# Altium project DC-DC_Conv_MCU.PrjPcb
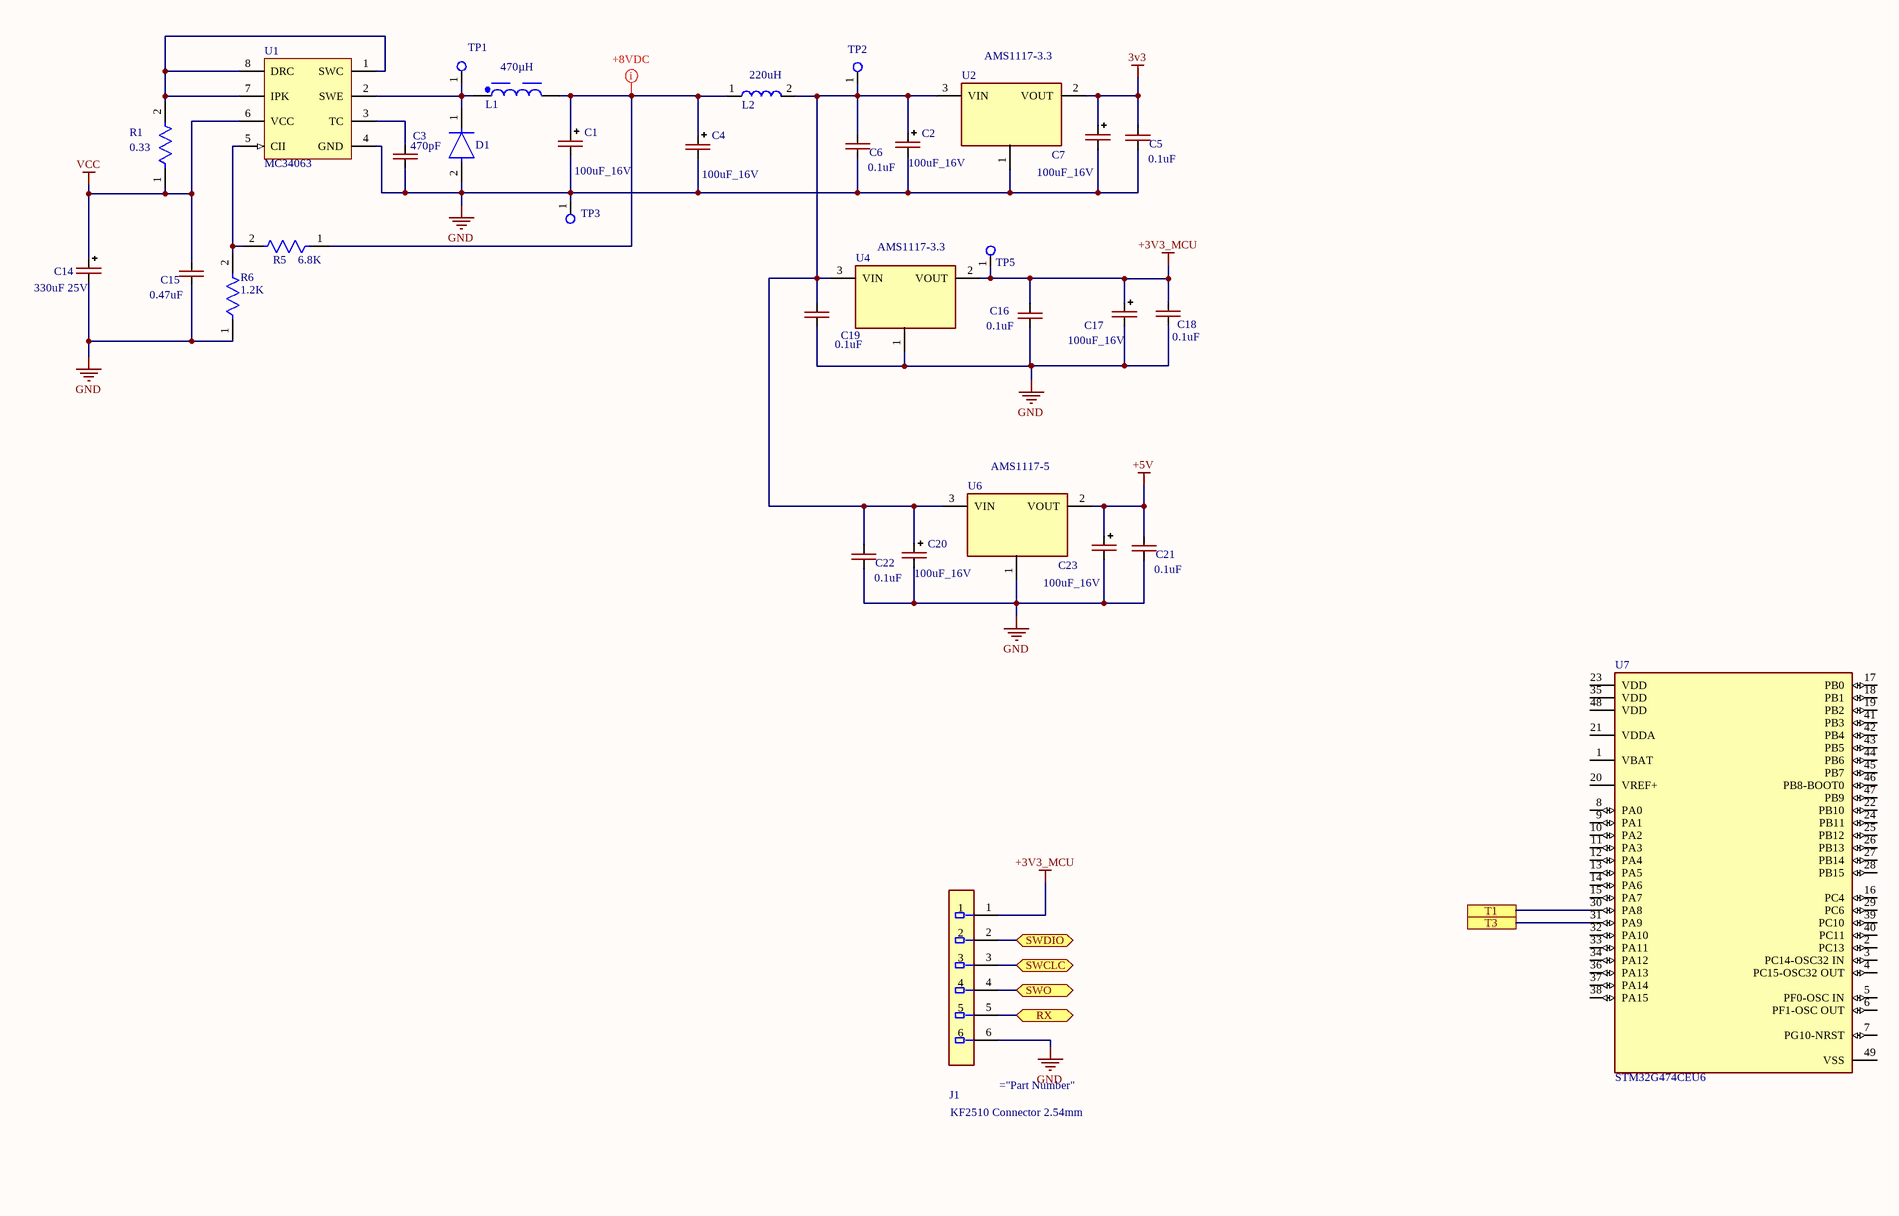
[diagram p0: DC-DC_Conv_MCU.SchDoc, top left]
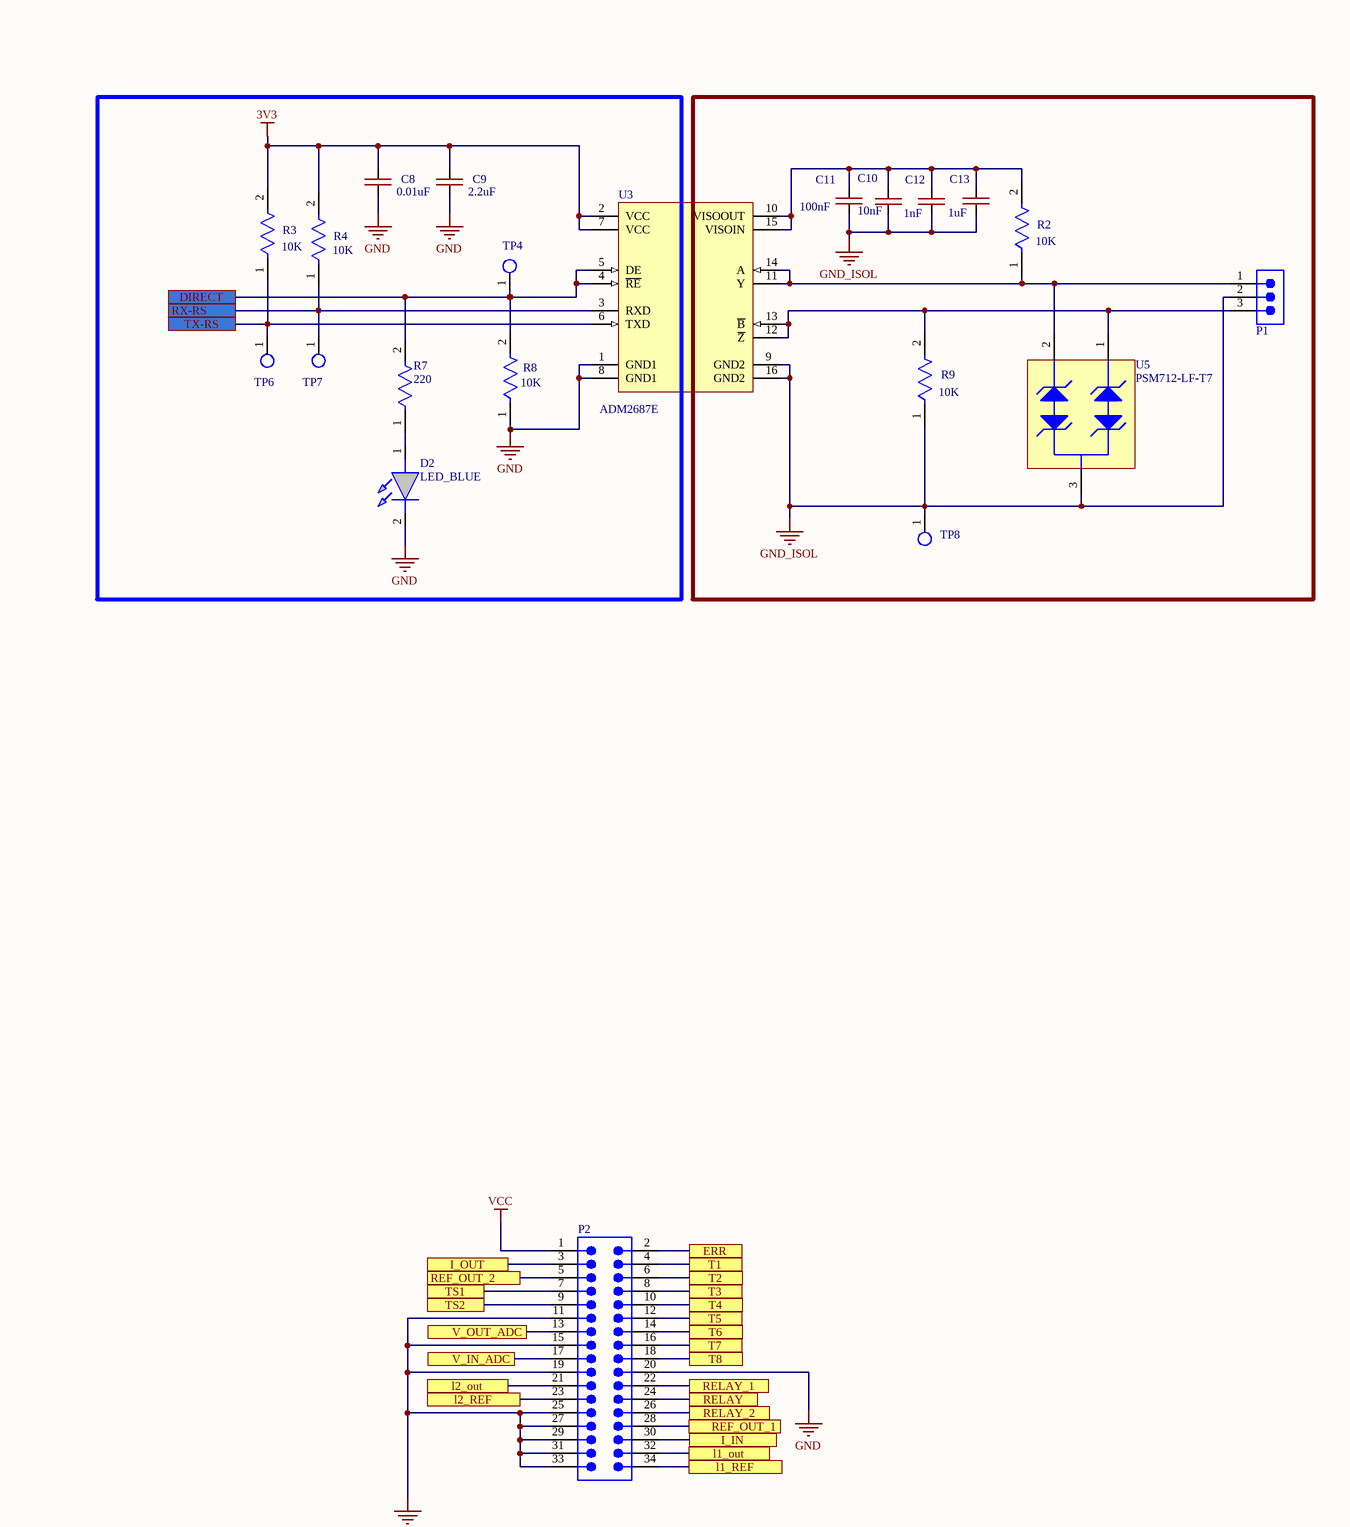
[diagram p1: DC-DC_Conv_MCU.SchDoc, top right]
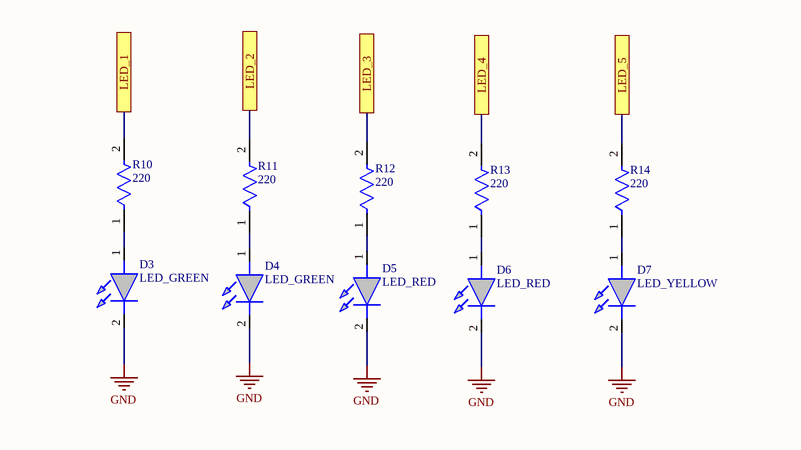
[diagram p2: DC-DC_Conv_MCU.SchDoc, bottom left]
1 sheet, 64 parts. Net scope: flat (ports and power ports of the same name join across sheets).
Board file: DC-DC_Conv_MCU.PcbDoc

## Sheet DC-DC_Conv_MCU.SchDoc
size A1; SheetNumber: 1; SheetTotal: 1; SPICEModelCacheFVOYAKUU: <root> / <DocumentId>FVOYAKUU</DocumentId> / <CacheFrame Number="0"> / <Model Name="5848_744774033_3.3u" Kind="CKT"> / <Text>******* / .subckt 5848_744774033_3.3u 1 2 / Rp 1 2 12000 / Cp 1 2 3.4p / Rs 1 N3 0.042 / L1 N3 2 3.3u / .ends 5848_744774033_3.3u</Text> / </Model> / </CacheFrame> / </root>

### Parts
C1  100uF_16V  [CAP-TAN-D]
C2  100uF_16V  [CAP-TAN-D]
C3  470pF  [CAP-0603]
C4  100uF_16V  [CAP-TAN-D]
C5  0.1uF  [CAP-0603]
C6  0.1uF  [CAP-0603]
C7  100uF_16V  [CAP-TAN-D]
C8  0.01uF  [CAP-0805]
C9  2.2uF  [CAP-0805]
C10  10nF  [CAP-0603]
C11  100nF  [CAP-0603]
C12  1nF  [CAP-0603]
C13  1uF  [CAP-0603]
C14  330uF 25V  [CAP_SMD_Size_E]
C15  0.47uF  [CAP-0805]
C16  0.1uF  [CAP-0603]
C17  100uF_16V  [CAP-TAN-D]
C18  0.1uF  [CAP-0603]
C19  0.1uF  [CAP-0603]
C20  100uF_16V  [CAP-TAN-D]
C21  0.1uF  [CAP-0603]
C22  0.1uF  [CAP-0603]
C23  100uF_16V  [CAP-TAN-D]
D1  ES1G  [FP-403AE-MFG]  (value not drawn)
D2  LED_BLUE  [LED_BLUE]
D3  LED_GREEN  [LED_GREEN]
D4  LED_GREEN  [LED_GREEN]
D5  LED_RED  [LED_RED]
D6  LED_RED  [LED_RED]
D7  LED_YELLOW  [LED_YELLOW]
J1  KF2510 Connector 2.54mm  [Sullins_SWR25X-NRTC-S06-ST-BA_MFG]
L1  470µH  [WE-PD2_5848]
L2  220uH  [Coil_4.5x4.5_mm]
P1  691305340003  [691305340003]  (value not drawn)
P2  61203421621  [61203421621]  (value not drawn)
R1  0.33  [RES-1206]
R2  10K  [RES-0603]
R3  10K  [RES-0603]
R4  10K  [RES-0603]
R5  6.8K  [RES-0805]
R6  1.2K  [RES-0805]
R7  220  [RES-0603]
R8  10K  [RES-0603]
R9  10K  [RES-0603]
R10  220  [RES-0603]
R11  220  [RES-0603]
R12  220  [RES-0603]
R13  220  [RES-0603]
R14  220  [RES-0603]
TP1  Test_Point_PCB  [Test_Point]  (value not drawn)
TP2  Test_Point_PCB  [Test_Point]  (value not drawn)
TP3  Test_Point_PCB  [Pin_Test_Point(Orange)]  (value not drawn)
TP4  Test_Point_PCB  [Test_Point]  (value not drawn)
TP5  Test_Point_PCB  [Test_Point]  (value not drawn)
TP6  Test_Point_PCB  [Test_Point]  (value not drawn)
TP7  Test_Point_PCB  [Test_Point]  (value not drawn)
TP8  Test_Point_PCB  [Test_Point]  (value not drawn)
U1  MC34063  [SOIC-8_M]
U2  AMS1117-3.3  [SOT-89]
U3  ADM2687E  [ADI-RI-16-2_M]
U4  AMS1117-3.3  [SOT-89]
U5  PSM712-LF-T7  [PRKT-SOT23-3_V]
U6  AMS1117-5  [SOT-89]
U7  STM32G474CEU6  [FP-UFQFPN48-A0B9-IPC_C]

### Ports
DIRECT, ERR, I_IN, I_OUT, l1_out, l1_REF, l2_out, l2_REF, LED_1, LED_2, LED_3, LED_4, LED_5, REF_OUT_1, REF_OUT_2, RELAY, RELAY_1, RELAY_2, RX (bidir), RX-RS, SWCLC (bidir), SWDIO (bidir), SWO (bidir), T1 (see DC-DC_Conv_MCU[5B]), T1 (see DC-DC_Conv_MCU[10B]), T2, T3 (see DC-DC_Conv_MCU[5B]), T3 (see DC-DC_Conv_MCU[10B]), T4, T5, T6, T7, T8, TS1, TS2, TX-RS, V_IN_ADC, V_OUT_ADC

### Nets
3v3: C5.2 C7.1(+) C8.1 C9.1 R3.2 R4.2 U2.2(VOUT) U3.2(VCC) U3.7(VCC)
+3V3_MCU: C16.2 C17.1(+) C18.2 J1.1 TP5.1(G9) U4.2(VOUT)
+5V: C21.2 C23.1(+) U6.2(VOUT)
GND: C1.2(-) C2.2(-) C3.2 C4.2(-) C5.1 C6.1 C7.2(-) C8.2 C9.2 C14.2(-) C15.2 C16.1 C17.2(-) C18.1 C19.1 C20.2(-) C21.1 C22.1 C23.2(-) D1.2(A) D2.2(K) D3.2(K) D4.2(K) D5.2(K) D6.2(K) D7.2(K) J1.6 P2.11 P2.15 P2.19 P2.20 P2.25 P2.27 P2.29 P2.31 P2.33 R6.1 R8.1 TP3.1(G9) U1.4(GND) U2.1(Ground) U3.1(GND1) U3.8(GND1) U4.1(Ground) U6.1(Ground)
GND_ISOL: C10.2 C11.2 C12.2 C13.2 P1.2 R9.1 TP8.1(G9) U3.9(GND2) U3.16(GND2) U5.3
VCC: C14.1(+) C15.1 P2.1 R1.1 U1.6(VCC)
NetC1_1: C1.1(+) C4.1(+) L1.2 L2.1 R5.1
NetC2_1: C2.1(+) C6.2 C19.2 C20.1(+) C22.2 L2.2 TP2.1(G9) U2.3(VIN) U4.3(VIN) U6.3(VIN)
NetC3_1: C3.1 U1.3(TC)
NetC10_1: C10.1 C11.1 C12.1 C13.1 R2.2 U3.10(VISOOUT) U3.15(VISOIN)
NetD1_1: D1.1(C) L1.1 TP1.1(G9) U1.2(SWE)
NetD2_1: D2.1(A) R7.1
NetD3_1: D3.1(A) R10.1
NetD4_1: D4.1(A) R11.1
NetD5_1: D5.1(A) R12.1
NetD6_1: D6.1(A) R13.1
NetD7_1: D7.1(A) R14.1
NetJ1_2: J1.2 ; port SWDIO
NetJ1_3: J1.3 ; port SWCLC
NetJ1_4: J1.4 ; port SWO
NetJ1_5: J1.5 ; port RX
NetP1_1: P1.1 R2.1 U3.11(Y) U3.14(A) U5.2
NetP1_3: P1.3 R9.2 U3.12(~{Z}) U3.13(~{B}) U5.1
NetP2_2: P2.2 ; port ERR
NetP2_3: P2.3 ; port I_OUT
NetP2_4: P2.4 U7.30(PA8) ; port T1
NetP2_5: P2.5 ; port REF_OUT_2
NetP2_6: P2.6 ; port T2
NetP2_7: P2.7 ; port TS1
NetP2_8: P2.8 U7.31(PA9) ; port T3
NetP2_9: P2.9 ; port TS2
NetP2_10: P2.10 ; port T4
NetP2_12: P2.12 ; port T5
NetP2_13: P2.13 ; port V_OUT_ADC
NetP2_14: P2.14 ; port T6
NetP2_16: P2.16 ; port T7
NetP2_17: P2.17 ; port V_IN_ADC
NetP2_18: P2.18 ; port T8
NetP2_21: P2.21 ; port l2_out
NetP2_22: P2.22 ; port RELAY_1
NetP2_23: P2.23 ; port l2_REF
NetP2_24: P2.24 ; port RELAY
NetP2_26: P2.26 ; port RELAY_2
NetP2_28: P2.28 ; port REF_OUT_1
NetP2_30: P2.30 ; port I_IN
NetP2_32: P2.32 ; port l1_out
NetP2_34: P2.34 ; port l1_REF
NetR1_2: R1.2 U1.1(SWC) U1.7(IPK) U1.8(DRC)
NetR3_1: R3.1 TP6.1(G9) U3.6(TXD) ; port TX-RS
NetR4_1: R4.1 TP7.1(G9) U3.3(RXD) ; port RX-RS
NetR5_2: R5.2 R6.2 U1.5(CII)
NetR7_2: R7.2 R8.2 TP4.1(G9) U3.4(~{RE}) U3.5(DE) ; port DIRECT
NetR10_2: R10.2 ; port LED_1
NetR11_2: R11.2 ; port LED_2
NetR12_2: R12.2 ; port LED_3
NetR13_2: R13.2 ; port LED_4
NetR14_2: R14.2 ; port LED_5

Not connected (* = marked no-connect by the designer): U7 1(VBAT) 2(PC13) 3(PC14-OSC32_IN) 4(PC15-OSC32_OUT) 5(PF0-OSC_IN) 6(PF1-OSC_OUT) 7(PG10-NRST) 8(PA0) 9(PA1) 10(PA2) 11(PA3) 12(PA4) 13(PA5) 14(PA6) 15(PA7) 16(PC4) 17(PB0) 18(PB1) 19(PB2) 20(VREF+) 21(VDDA) 22(PB10) 23(VDD) 24(PB11) 25(PB12) 26(PB13) 27(PB14) 28(PB15) 29(PC6) 32(PA10) 33(PA11) 34(PA12) 35(VDD) 36(PA13) 37(PA14) 38(PA15) 39(PC10) 40(PC11) 41(PB3) 42(PB4) 43(PB5) 44(PB6) 45(PB7) 46(PB8-BOOT0) 47(PB9) 48(VDD) 49(VSS)

### Layout directives
mark named +8VDC: (no net found under the mark)

### Library data of the parts
C1 C2 C4 C7 C14 C20 C23 = CAP_POL_SMD
C3 C5 C6 C8-C13 C15 C16 C18 C19 C21 C22 = CAP-NON-POLAR
C17 = CAP-POLAR
D1 = ES1G: Ultrafast
D2 = LED: 0805; Manufacturer_Name: Wurth Elektronik; Manufacturer_Part_Number: 151031YS06000; Geometry.Height: 5.5mm; Mouser Part Number: 710-151031YS06000; Mouser Price/Stock: https://www.mouser.co.uk/ProductDetail/Wurth-Elektronik/151031YS06000?qs=LlUlMxKIyB3xSYYW%252BcuBiQ%3D%3D; Arrow Part Number: *; Arrow Price/Stock: *; Mouser Testing Part Number: *; Mouser Testing Price/Stock: *; Datasheet Link: https://katalog.we-online.de/led/datasheet/151031YS06000.pdf
D3-D7 = LED: Manufacturer_Name: Wurth Elektronik; Manufacturer_Part_Number: 151031YS06000; Geometry.Height: 5.5mm; Mouser Part Number: 710-151031YS06000; Mouser Price/Stock: https://www.mouser.co.uk/ProductDetail/Wurth-Elektronik/151031YS06000?qs=LlUlMxKIyB3xSYYW%252BcuBiQ%3D%3D; Arrow Part Number: *; Arrow Price/Stock: *; Mouser Testing Part Number: *; Mouser Testing Price/Stock: *; Datasheet Link: https://katalog.we-online.de/led/datasheet/151031YS06000.pdf
J1 = SWR25X-NRTC-S06-ST-BA
L1 = 744774033: MSRH5D28-471MT; Manufacturer: Wurth Elektronik; Match Code: WE-PD2; Case/Size Code: 5848; DC Resistance: 0.042Ω; DC Resistance Max: 0.06Ω; Inductance: 3.3µH; Rated Current: 4A; Saturation Current: 7.5A; Self Resonant Frequency: 43MHz; Manufacturer Part Number: 744774033; Category: Unshielded Power Inductors; ComponentLink1Description: Website Link; ComponentLink1URL: https://www.we-online.com/redexpert/article/744774033?ad; ComponentLink2Description: Datasheet Link; ComponentLink2URL: https://www.we-online.com/redexpert/spec/744774033?ad; Mount: Surface Mount; Operating Temperature Max: 125°C; Operating Temperature Min: -40°C; Packaging: Tape and Reel; Length: 5.8mm; Width: 5.2mm; Height: 4.5mm
L2 = Coil
P1 = 691305340003: WR-TBL Series 3053 Horizontal PCB Header, THT, pitch 3.81mm, 3p; Manufacturer: Wurth Elektronik; Modularity: No; Rated Current: 12A; Working Voltage: 300V; ComponentLink1Description: Website Link; ComponentLink1URL: https://www.we-online.com/redexpert/article/691305340003?ad; ComponentLink2Description: Datasheet Link; ComponentLink2URL: https://www.we-online.com/redexpert/spec/691305340003?ad; Manufacturer Part Number: 691305340003; Category: Terminal Blocks; Match Code: WR-TBL; Mount: Through Hole; Operating Temperature Max: 105°C; Operating Temperature Min: -40°C; Packaging: Box; Application: Pluggable; Number of Pins: 3; Number of Rows: 1; Orientation: Horizontal; Pitch: 3.81mm
P2 = 61203421621: WR-BHD Male Box Header, THT Straight, pitch 2.54 mm, 2 Rows, 34 Pins; Manufacturer: Wurth Elektronik; Contact Resistance: 20 mΩ; Insulation Resistance: 1000 MΩ; Pitch: 2.54 mm; Rated Current: 3 A; Working Voltage: 250 V; Withstanding Voltage: 500 V; Manufacturer Part Number: 61203421621; Category: Wire-to-Board Connector; Connectors.Match Code: WR-BHD; ComponentLink1Description: Website Link; ComponentLink1URL: https://www.we-online.com/redexpert/article/61203421621?ad; ComponentLink2Description: Datasheet Link; ComponentLink2URL: https://www.we-online.com/redexpert/spec/61203421621?ad; Mount: Through Hole; Min Operating Temperature: -40 °C; Max Operating Temperature: 105 °C; Packaging: Tray; Length: 50.84 mm; Width: 9.1 mm; Height: 9.1 mm; Gender: Male; Number of Pins: 34; Number of Rows: 2; Orientation: Straight
R1-R14 = RES-CONST
TP1-TP8 = TP_PCB?: Test_Point
U2 U4 U6 = AMS1117
U5 = CMP-2000-07553-1: TVS Array - Asymmetrical Data Line Protector, 600 W, 7.5 V, -55 to 150 degC, 3-Pin SOT23, RoHS, Tape and Reel; Manufacturer: Protek Devices; Min Breakdown Voltage: 7.5V; Direction: Bidirectional; Capacitance: 75pF; Current: 20uA; Power Dissipation: 600W; Working Voltage: 7V; Voltage: 12V; Case\/Package: SOT-23; Clamping Voltage: 17V; Element Configuration: Dual; Mounting Technology: SurfaceMount; RoHSCompliant: True; Radiation Hardening: No; Depth: 1.4mm; Lead Free: LeadFree; Package Description: 3-Pin Small Outline Transistor, Body 2.92 x 1.3 mm, Pitch 0.94 mm; Max Operating Temperature: 150degC; Length: 3.04mm; Manufacturer URL: http://www.protekdevices.com/; Min Operating Temperature: -55degC; Leakage Current: 20uA; Datasheet URL: www.protekdevices.com/xyz/documents/datasheets/psm712.pdf; Packaging: TapeandReel; Datasheet Version: 10/2013; Package Reference: SOT23-3; Number of Pins: 3
U7 = CMP-12105-000082-1: MAINSTREAM ARM CORTEX-M4 CORE WI